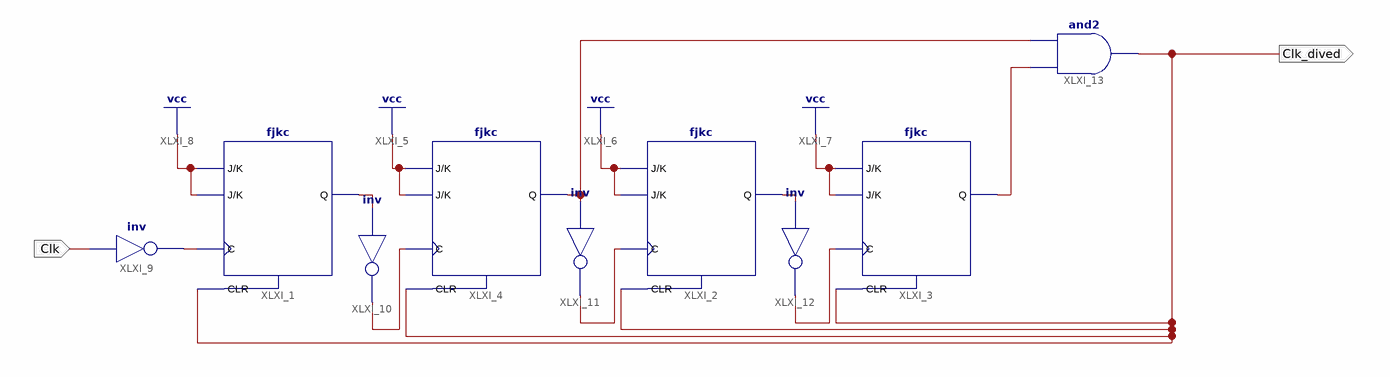
[diagram p0: schematic sheet 1]
// Xilinx ISE schematic div_10.sch (spartan6) as structural Verilog: 9 symbols, 2 ports
module div_10 (
  input  Clk,
  output Clk_dived
);

  wire XLXN_5, XLXN_6, XLXN_7, XLXN_8, XLXN_9, XLXN_10, XLXN_12, XLXN_17;

  fjkc XLXI_1 (.C(XLXN_17), .CLR(Clk_dived), .J(1'b1), .K(1'b1), .Q(XLXN_5));
  fjkc XLXI_2 (.C(XLXN_7), .CLR(Clk_dived), .J(1'b1), .K(1'b1), .Q(XLXN_8));
  fjkc XLXI_3 (.C(XLXN_9), .CLR(Clk_dived), .J(1'b1), .K(1'b1), .Q(XLXN_10));
  fjkc XLXI_4 (.C(XLXN_6), .CLR(Clk_dived), .J(1'b1), .K(1'b1), .Q(XLXN_12));
  not XLXI_9 (XLXN_17, Clk);
  not XLXI_10 (XLXN_6, XLXN_5);
  not XLXI_11 (XLXN_7, XLXN_12);
  not XLXI_12 (XLXN_9, XLXN_8);
  and XLXI_13 (Clk_dived, XLXN_10, XLXN_12);
endmodule
